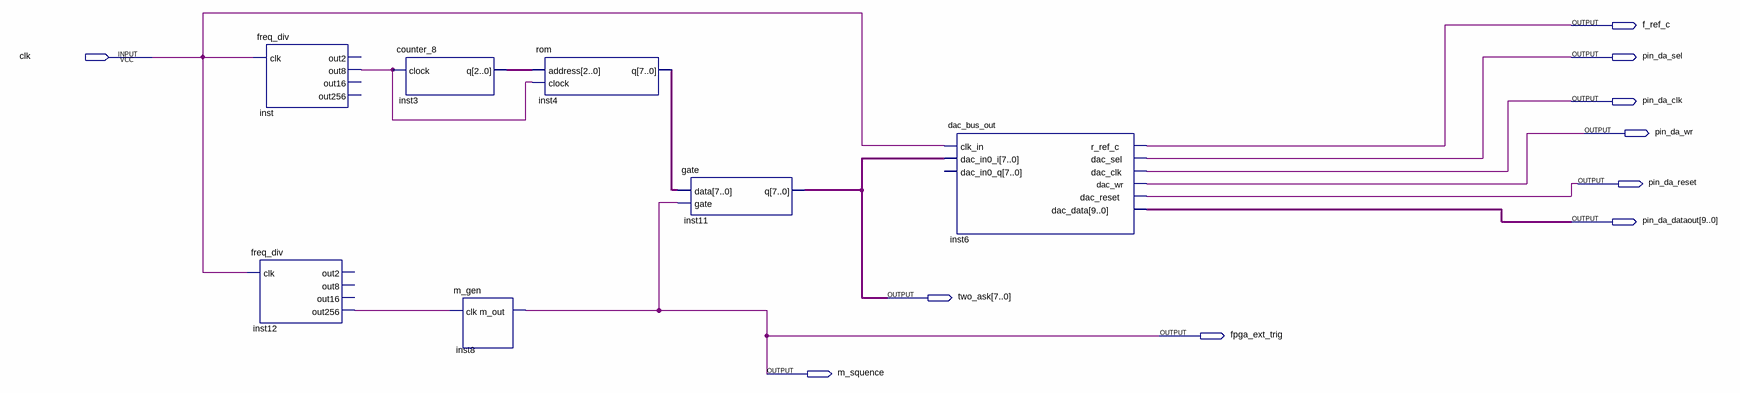
[diagram p0: schematic sheet]
// Quartus schematic twoask.bdf as structural Verilog: 7 symbols, 10 pins
module twoask (
  input  clk,
  output f_ref_c,
  output pin_da_sel,
  output pin_da_clk,
  output pin_da_wr,
  output pin_da_reset,
  output [9:0] pin_da_dataout,
  output [7:0] two_ask,
  output fpga_ext_trig,
  output m_squence
);

  wire inst12_out256, inst_out8;
  wire [2:0] inst3_q;
  wire [7:0] inst4_q;

  freq_div inst12 (.clk(clk), .out256(inst12_out256));  // open: out2, out8, out16
  freq_div inst (.clk(clk), .out8(inst_out8));  // open: out2, out16, out256
  counter_8 inst3 (.clock(inst_out8), .q(inst3_q));
  m_gen inst8 (.clk(inst12_out256), .m_out(fpga_ext_trig));
  rom inst4 (.address(inst3_q), .clock(inst_out8), .q(inst4_q));
  gate inst11 (.data(inst4_q), .gate(fpga_ext_trig), .q(two_ask));
  dac_bus_out inst6 (
    .clk_in(clk), .dac_in0_i(two_ask), .r_ref_c(f_ref_c), .dac_sel(pin_da_sel), .dac_clk(pin_da_clk),
    .dac_wr(pin_da_wr), .dac_reset(pin_da_reset), .dac_data(pin_da_dataout));  // open: dac_in0_q

  assign m_squence = fpga_ext_trig;
endmodule
